# Altium schematic sheet 3_DAC.schdoc
size 431 x 309 mm; Symbol: Sheet-Symbol_A4; Device: Sheet-Symbol_A4; Company: EasyEDA.com; Drawed: EasyEDA Pro; Reviewed: EasyEDA Pro; Version: V0.1; Page Size: A4; @Project Name: Scanning Tunneling Microscope; @Page Count: 3; @Update Date: 2023-05-18; @Create Date: 2023-04-30; @Schematic Name: Controller; Part Number: JLCPCB-002; @Page No: 1; @Page Name: DAC
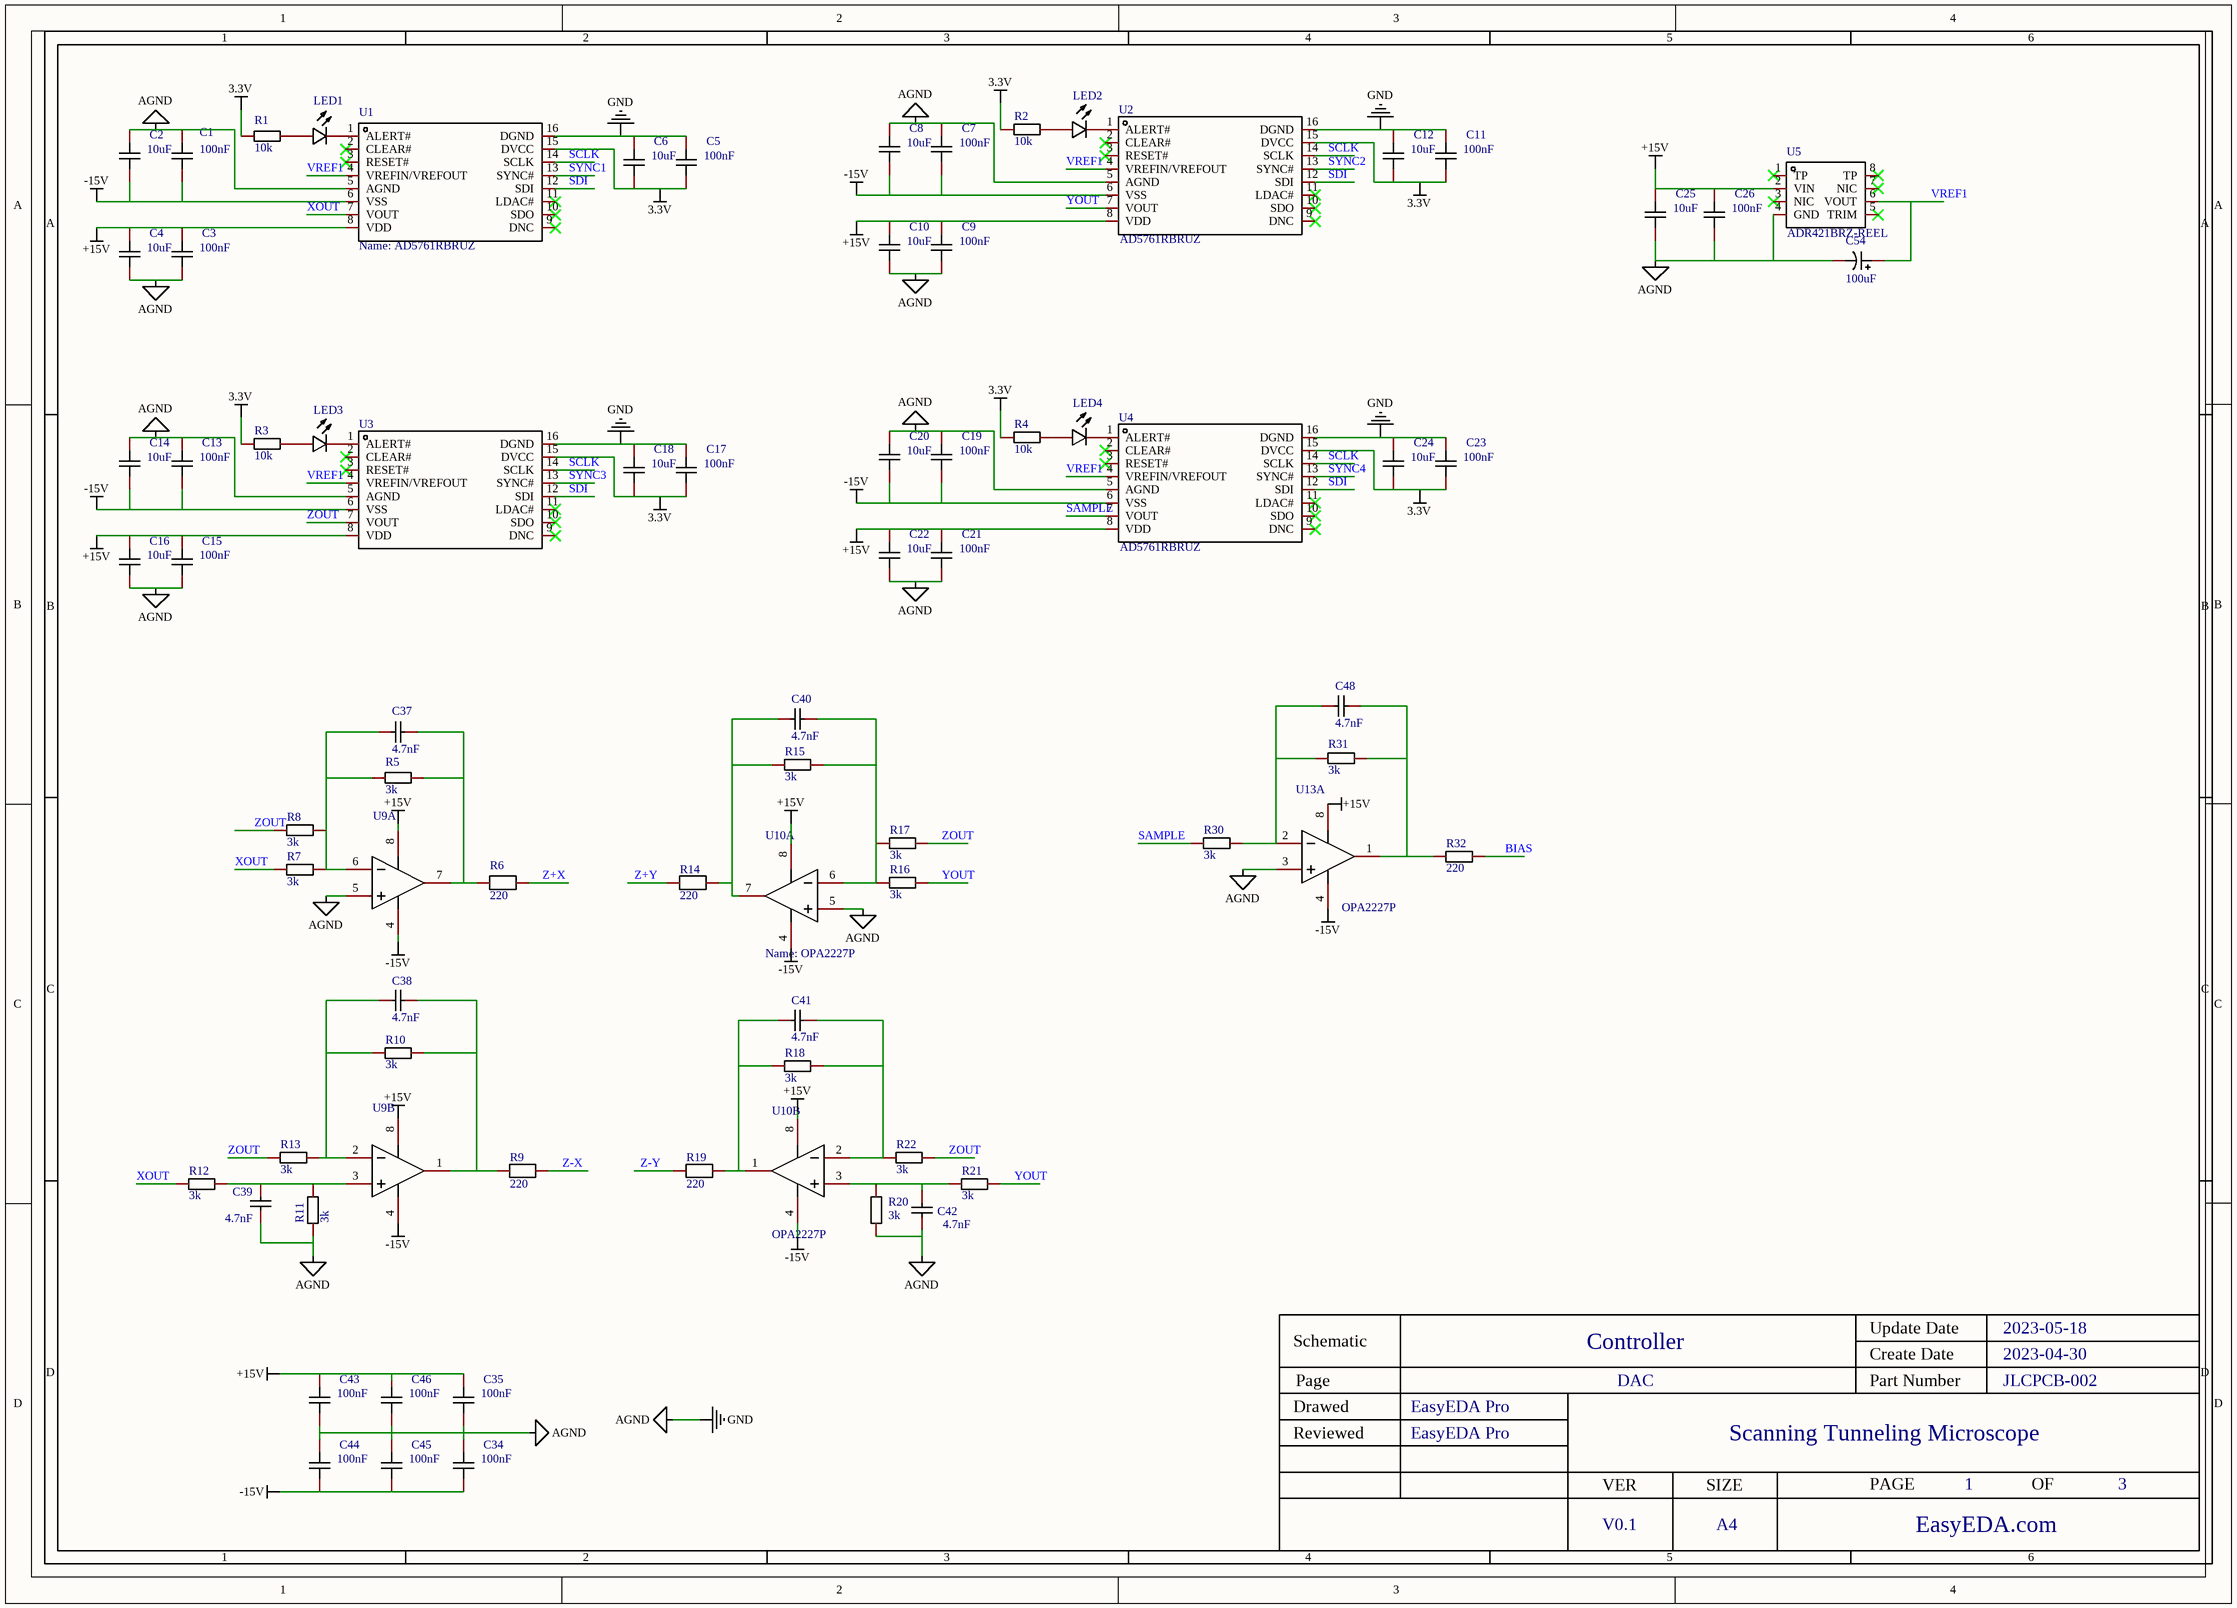
[diagram p0: 3_DAC.schdoc]

## Parts
C1  value 100nF  [C0603]  (hidden comment: CL10B104KA8NNNC)
C2  value 10uF  [C0603]  (hidden comment: GRM188R61E106MA73D)
C3  value 100nF  [C0603]  (hidden comment: CL10B104KA8NNNC)
C4  value 10uF  [C0603]  (hidden comment: GRM188R61E106MA73D)
C5  value 100nF  [C0603]  (hidden comment: CL10B104KA8NNNC)
C6  value 10uF  [C0603]  (hidden comment: GRM188R61E106MA73D)
C7  value 100nF  [C0603]  (hidden comment: CL10B104KA8NNNC)
C8  value 10uF  [C0603]  (hidden comment: GRM188R61E106MA73D)
C9  value 100nF  [C0603]  (hidden comment: CL10B104KA8NNNC)
C10  value 10uF  [C0603]  (hidden comment: GRM188R61E106MA73D)
C11  value 100nF  [C0603]  (hidden comment: CL10B104KA8NNNC)
C12  value 10uF  [C0603]  (hidden comment: GRM188R61E106MA73D)
C13  value 100nF  [C0603]  (hidden comment: CL10B104KA8NNNC)
C14  value 10uF  [C0603]  (hidden comment: GRM188R61E106MA73D)
C15  value 100nF  [C0603]  (hidden comment: CL10B104KA8NNNC)
C16  value 10uF  [C0603]  (hidden comment: GRM188R61E106MA73D)
C17  value 100nF  [C0603]  (hidden comment: CL10B104KA8NNNC)
C18  value 10uF  [C0603]  (hidden comment: GRM188R61E106MA73D)
C19  value 100nF  [C0603]  (hidden comment: CL10B104KA8NNNC)
C20  value 10uF  [C0603]  (hidden comment: GRM188R61E106MA73D)
C21  value 100nF  [C0603]  (hidden comment: CL10B104KA8NNNC)
C22  value 10uF  [C0603]  (hidden comment: GRM188R61E106MA73D)
C23  value 100nF  [C0603]  (hidden comment: CL10B104KA8NNNC)
C24  value 10uF  [C0603]  (hidden comment: GRM188R61E106MA73D)
C25  value 10uF  [C0603]  (hidden comment: GRM188R61E106MA73D)
C26  value 100nF  [C0603]  (hidden comment: CL10B104KA8NNNC)
C34  value 100nF  [C0603]  (hidden comment: CL10B104KA8NNNC)
C35  value 100nF  [C0603]  (hidden comment: CL10B104KA8NNNC)
C37  value 4.7nF  [C0603]  (hidden comment: 0603B472K500NT)
C38  value 4.7nF  [C0603]  (hidden comment: 0603B472K500NT)
C39  value 4.7nF  [C0603]  (hidden comment: 0603B472K500NT)
C40  value 4.7nF  [C0603]  (hidden comment: 0603B472K500NT)
C41  value 4.7nF  [C0603]  (hidden comment: 0603B472K500NT)
C42  value 4.7nF  [C0603]  (hidden comment: 0603B472K500NT)
C43  value 100nF  [C0603]  (hidden comment: CL10B104KA8NNNC)
C44  value 100nF  [C0603]  (hidden comment: CL10B104KA8NNNC)
C45  value 100nF  [C0603]  (hidden comment: CL10B104KA8NNNC)
C46  value 100nF  [C0603]  (hidden comment: CL10B104KA8NNNC)
C48  value 4.7nF  [C0603]  (hidden comment: 0603B472K500NT)
C54  100uF  [CAP-SMD_L7.3-W4.3-FD]
LED1  19-217/R6C-AL1M2VY/3T  [LED0603-R-RD]  (value not drawn)
LED2  19-217/R6C-AL1M2VY/3T  [LED0603-R-RD]  (value not drawn)
LED3  19-217/R6C-AL1M2VY/3T  [LED0603-R-RD]  (value not drawn)
LED4  19-217/R6C-AL1M2VY/3T  [LED0603-R-RD]  (value not drawn)
R1  value 10k  [R0603]  (hidden comment: 0603WAF1002T5E)
R2  value 10k  [R0603]  (hidden comment: 0603WAF1002T5E)
R3  value 10k  [R0603]  (hidden comment: 0603WAF1002T5E)
R4  value 10k  [R0603]  (hidden comment: 0603WAF1002T5E)
R5  value 3k  [R0603]  (hidden comment: ARG03DTC3001)
R6  value 220  [R0603]  (hidden comment: ERJU3RD2200V)
R7  value 3k  [R0603]  (hidden comment: ARG03DTC3001)
R8  value 3k  [R0603]  (hidden comment: ARG03DTC3001)
R9  value 220  [R0603]  (hidden comment: ERJU3RD2200V)
R10  value 3k  [R0603]  (hidden comment: ARG03DTC3001)
R11  value 3k  [R0603]  (hidden comment: ARG03DTC3001)
R12  value 3k  [R0603]  (hidden comment: ARG03DTC3001)
R13  value 3k  [R0603]  (hidden comment: ARG03DTC3001)
R14  value 220  [R0603]  (hidden comment: ERJU3RD2200V)
R15  value 3k  [R0603]  (hidden comment: ARG03DTC3001)
R16  value 3k  [R0603]  (hidden comment: ARG03DTC3001)
R17  value 3k  [R0603]  (hidden comment: ARG03DTC3001)
R18  value 3k  [R0603]  (hidden comment: ARG03DTC3001)
R19  value 220  [R0603]  (hidden comment: ERJU3RD2200V)
R20  value 3k  [R0603]  (hidden comment: ARG03DTC3001)
R21  value 3k  [R0603]  (hidden comment: ARG03DTC3001)
R22  value 3k  [R0603]  (hidden comment: ARG03DTC3001)
R30  value 3k  [R0603]  (hidden comment: ARG03DTC3001)
R31  value 3k  [R0603]  (hidden comment: ARG03DTC3001)
R32  value 220  [R0603]  (hidden comment: ARG03DTC3001)
U1  AD5761RBRUZ  [TSSOP-16_L5.0-W4.4-P0.65-LS6.4-TL]
U2  AD5761RBRUZ  [TSSOP-16_L5.0-W4.4-P0.65-LS6.4-TL]
U3  AD5761RBRUZ  [TSSOP-16_L5.0-W4.4-P0.65-LS6.4-TL]  (value not drawn)
U4  AD5761RBRUZ  [TSSOP-16_L5.0-W4.4-P0.65-LS6.4-TL]
U5  ADR421BRZ-REEL  [SOIC-8_L4.9-W3.9-P1.27-LS6.0-BL]
U9  OPA2227P  [PDIP-8_L9.6-W6.4-P2.54-LS7.6-BL]  (value not drawn)  (parts A,B of 2)
U10  OPA2227P  [PDIP-8_L9.6-W6.4-P2.54-LS7.6-BL]  (parts A,B of 2)
U13  OPA2227P  [PDIP-8_L9.6-W6.4-P2.54-LS7.6-BL]  (part A of 2)

## Nets
3.3V: C5.1 C6.1 C11.1 C12.1 C17.1 C18.1 C23.1 C24.1 R1.1 R2.1 R3.1 R4.1 U1.15(DVCC) U2.15(DVCC) U3.15(DVCC) U4.15(DVCC)
+15V: C3.2 C4.2 C9.2 C10.2 C15.2 C16.2 C21.2 C22.2 C25.2 C26.2 C35.2 C43.2 C46.2 U1.8(VDD) U2.8(VDD) U3.8(VDD) U4.8(VDD) U5.2(VIN) U9.8(V+) U10.8(V+) U13.8(V+)
-15V: C1.1 C2.1 C7.1 C8.1 C13.1 C14.1 C19.1 C20.1 C34.1 C44.1 C45.1 U1.6(VSS) U2.6(VSS) U3.6(VSS) U4.6(VSS) U9.4(V-) U10.4(V-) U13.4(V-)
AGND: C1.2 C2.2 C3.1 C4.1 C5.2 C6.2 C7.2 C8.2 C9.1 C10.1 C11.2 C12.2 C13.2 C14.2 C15.1 C16.1 C17.2 C18.2 C19.2 C20.2 C21.1 C22.1 C23.2 C24.2 C25.1 C26.1 C34.2 C35.1 C39.1 C42.2 C43.1 C44.2 C45.2 C46.1 C54.2 R11.1 R20.2 U1.5(AGND) U1.16(DGND) U2.5(AGND) U2.16(DGND) U3.5(AGND) U3.16(DGND) U4.5(AGND) U4.16(DGND) U5.4(GND) U9.5(IN_B+) U10.5(IN_B+) U13.3(INA+)  [also labelled GND]
BIAS: R32.2
SAMPLE: R30.1 U4.7(VOUT)
SCLK: U1.14(SCLK) U2.14(SCLK) U3.14(SCLK) U4.14(SCLK)
SDI: U1.12(SDI) U2.12(SDI) U3.12(SDI) U4.12(SDI)
SYNC1: U1.13(SYNC#)
SYNC2: U2.13(SYNC#)
SYNC3: U3.13(SYNC#)
SYNC4: U4.13(SYNC#)
VREF1: C54.1 U1.4(VREFIN/VREFOUT) U2.4(VREFIN/VREFOUT) U3.4(VREFIN/VREFOUT) U4.4(VREFIN/VREFOUT) U5.6(VOUT)
XOUT: R7.1 R12.1 U1.7(VOUT)
YOUT: R16.2 R21.2 U2.7(VOUT)
Z+X: R6.2
Z+Y: R14.1
Z-X: R9.2
Z-Y: R19.1
ZOUT: R8.1 R13.1 R17.2 R22.2 U3.7(VOUT)
NetC37_1: C37.1 R5.1 R7.2 R8.2 U9.6(IN_B-)
NetC37_2: C37.2 R5.2 R6.1 U9.7(OUT_B)
NetC38_1: C38.1 R10.1 R13.2 U9.2(IN_A-)
NetC38_2: C38.2 R9.1 R10.2 U9.1(OUT_A)
NetC39_2: C39.2 R11.2 R12.2 U9.3(IN_A+)
NetC40_1: C40.1 R14.2 R15.1 U10.7(OUT_B)
NetC40_2: C40.2 R15.2 R16.1 R17.1 U10.6(IN_B-)
NetC41_1: C41.1 R18.1 R19.2 U10.1(OUT_A)
NetC41_2: C41.2 R18.2 R22.1 U10.2(IN_A-)
NetC42_1: C42.1 R20.1 R21.1 U10.3(IN_A+)
NetC48_1: C48.1 R30.2 R31.1 U13.2(INA-)
NetC48_2: C48.2 R31.2 R32.1 U13.1(OUTA)
NetLED1_1: LED1.1(A) R1.2
NetLED1_2: LED1.2(C) U1.1(ALERT#)
NetLED2_1: LED2.1(A) R2.2
NetLED2_2: LED2.2(C) U2.1(ALERT#)
NetLED3_1: LED3.1(A) R3.2
NetLED3_2: LED3.2(C) U3.1(ALERT#)
NetLED4_1: LED4.1(A) R4.2
NetLED4_2: LED4.2(C) U4.1(ALERT#)

Not connected (* = marked no-connect by the designer): U1 2(CLEAR#)* 3(RESET#)* 9(DNC)* 10(SDO)* 11(LDAC#)*; U2 2(CLEAR#)* 3(RESET#)* 9(DNC)* 10(SDO)* 11(LDAC#)*; U3 2(CLEAR#)* 3(RESET#)* 9(DNC)* 10(SDO)* 11(LDAC#)*; U4 2(CLEAR#)* 3(RESET#)* 9(DNC)* 10(SDO)* 11(LDAC#)*; U5 1(TP)* 3(NIC)* 5(TRIM)* 7(NIC)* 8(TP)*

## Notes on the sheet
- 1
- 2
- 3
- 4
- 5
- 6
- A
- B
- C
- D
- Schematic
- Controller
- Create Date
- Update Date
- 2023-05-18
- 2023-04-30
- Reviewed
- Drawed
- Page
- EasyEDA Pro
- DAC
- Part Number
- Scanning Tunneling Microscope
- JLCPCB-002
- VER
- SIZE
- PAGE
- OF
- V0.1
- A4
- EasyEDA.com

## Library data of the parts
C1 C3 C5 C7 C9 C11 C13 C15 C17 C19 C21 C23 C26 C34 C35 C43-C46 = CL10B104KA8NNNC: 容值:100nF;精度:±10%;额定电压:25V;温度系数:X7R;; Manufacturer: SAMSUNG(三星); Add into BOM: yes; Tolerance: ±10%; Voltage Rated: 25V; Temperature Coefficient: X7R; Symbol: CL10B104KA8NNNC; Device: CL10B104KA8NNNC; LCSC Part Name: 100nF ±10% 25V; Supplier Part: C1590; Manufacturer Part: CL10B104KA8NNNC; Supplier Footprint: 0603; JLCPCB Part Class: Extended Part; Datasheet: https://atta.szlcsc.com/upload/public/pdf/source/20160103/1457707680294.pdf; Supplier: LCSC; Convert to PCB: yes
C2 C4 C6 C8 C10 C12 C14 C16 C18 C20 C22 C24 C25 = GRM188R61E106MA73D: 容值:10uF;精度:±20%;额定电压:25V;温度系数:X5R;; Manufacturer: muRata(村田); Add into BOM: yes; Tolerance: ±20%; Voltage Rated: 25V; Temperature Coefficient: X5R; Symbol: GRM188R61E106MA73D; Device: GRM188R61E106MA73D; LCSC Part Name: 10uF ±20% 25V; Supplier Part: C91606; Manufacturer Part: GRM188R61E106MA73D; Supplier Footprint: 0603; JLCPCB Part Class: Extended Part; Datasheet: https://atta.szlcsc.com/upload/public/pdf/source/20161226/1482720176185.pdf; Supplier: LCSC; Convert to PCB: yes
C37-C42 C48 = 0603B472K500NT: 容值:4.7nF;精度:±10%;额定电压:50V;温度系数:X7R;; Manufacturer: FH(风华); Add into BOM: yes; Tolerance: ±10%; Voltage Rated: 50V; Temperature Coefficient: X7R; Symbol: 0603B472K500NT; Device: 0603B472K500NT; LCSC Part Name: 4.7nF ±10% 50V; Supplier Part: C53987; Manufacturer Part: 0603B472K500NT; Supplier Footprint: 0603; JLCPCB Part Class: Basic Part; Datasheet: https://atta.szlcsc.com/upload/public/pdf/source/20170923/C53987_1506149489951988835.pdf; Supplier: LCSC; Convert to PCB: yes
C54 = F931D107MNC: Capacitance: Tolerance:±20% Tolerance:±20% Rated Voltage: Leakage Current(DCL):- Ripple Current:- Equivalent Series Resistance(ESR):500mΩ@100kHz Operating Temperature:-55℃~+125℃ Operating Temperature:-55℃~+125℃; Manufacturer: Kyocera AVX; Add into BOM: yes; Tolerance: ±20%; Name: 100uF; Symbol: F931D107MNC; Device: F931D107MNC; LCSC Part Name: 100uF ±20% 20V; Supplier Part: C1870833; Manufacturer Part: F931D107MNC; Supplier Footprint: 2917; JLCPCB Part Class: Extended Part; Supplier: LCSC; Convert to PCB: yes; Value: 100uF; Leakage Current(DCL): -; Ripple Current: -; Equivalent Series Resistance(ESR): 500mΩ@100kHz; Operating Temperature: -55℃~+125℃
LED1-LED4 = 19-217/R6C-AL1M2VY/3T: 发光颜色:红灯;二极管配置:-;透镜颜色:无色透明;主波长:617.5nm;峰值波长:632nm;色温:-;光通量(25时):-;测试电流:5mA;正向电压(VF):2.2V;发光强度:28.5mcd;功率:60mW;发光角度:120°;安装方式:-;工作温度:-40~+85;; Manufacturer: EVERLIGHT(台湾亿光); Add into BOM: yes; Emitted Color: 红灯; Lens Color: 无色透明; Peak Wavelength: 632nm; Forward Current: 5mA; Forward Voltage (VF): 2.2V; Power Dissipation: 60mW; Viewing Angle: 120°; Symbol: 19-217/R6C-AL1M2VY/3T; Device: 19-217/R6C-AL1M2VY/3T; LCSC Part Name: 0603 红灯; Supplier Part: C72044; Manufacturer Part: 19-217/R6C-AL1M2VY/3T; Supplier Footprint: 0603; JLCPCB Part Class: Extended Part; Datasheet: https://atta.szlcsc.com/upload/public/pdf/source/20160507/1462613613821.pdf; Supplier: LCSC; Convert to PCB: yes; Diode Configuration: -; Dominant Wavelength: 617.5nm; Color Temperature: -; Luminous Flux (@25℃): -; Luminous Intensity: 28.5mcd; Mounting Sytle: -; Operating Temperature: -40~+85
R1-R4 = 0603WAF1002T5E: 电阻类型:厚膜电阻;阻值:10k;精度:±1%;功率:1/10W;温度系数:±100ppm/;最大工作电压:75V;工作温度范围:-55~+155;; Manufacturer: UNI-ROYAL(厚声); Add into BOM: yes; Tolerance: ±1%; Power(Watts): 1/10W; Overload Voltage (Max): 75V; Symbol: 0603WAF1002T5E; Device: 0603WAF1002T5E; LCSC Part Name: 10k ±1%; Supplier Part: C25804; Manufacturer Part: 0603WAF1002T5E; Supplier Footprint: 0603; JLCPCB Part Class: Basic Part; Datasheet: https://atta.szlcsc.com/upload/public/pdf/source/20200306/C422600_1E6D84923E4A46A82E41ADD87F860B5C.pdf; Supplier: LCSC; Convert to PCB: yes; Type: 厚膜电阻; Temperature Coefficient: ±100ppm/; Operating Temperature Range: -55~+155
R5 R7 R8 R10-R13 R15-R18 R20-R22 R30-R32 = ARG03DTC3001: 电阻类型:薄膜电阻;阻值:3k;精度:±0.5%;功率:100mW;温度系数:±25ppm/;最大工作电压:75V;工作温度范围:-55~+155;; Manufacturer: 光颉(Viking); Add into BOM: yes; Tolerance: ±0.5%; Power(Watts): 100mW; Temperature Coefficient: ±25ppm/; Overload Voltage (Max): 75V; Symbol: ARG03DTC3001; Device: ARG03DTC3001; LCSC Part Name: 3k ±0.5% 100mW; Supplier Part: C311916; Manufacturer Part: ARG03DTC3001; Supplier Footprint: 0603; JLCPCB Part Class: Extended Part; Datasheet: https://atta.szlcsc.com/upload/public/pdf/source/20181119/C311916_083AB72433BF5B624DBE6C035DD51480.pdf; Supplier: LCSC; Convert to PCB: yes; Type: 薄膜电阻; Operating Temperature Range: -55~+155
R6 R9 R14 R19 = ERJU3RD2200V: 阻值:220;精度:±0.5%;功率:100mW;温度系数:±50ppm/;最大工作电压:-;工作温度范围:-55~+155;; Manufacturer: PANASONIC(松下); Add into BOM: yes; Tolerance: ±0.5%; Power(Watts): 100mW; Temperature Coefficient: ±50ppm/; Symbol: ERJU3RD2200V; Device: ERJU3RD2200V; LCSC Part Name: 220 ±0.5% 100mW; Supplier Part: C491169; Manufacturer Part: ERJU3RD2200V; Supplier Footprint: 0603; JLCPCB Part Class: Extended Part; Datasheet: https://atta.szlcsc.com/upload/public/pdf/source/20200407/C491169_AC2E94AF70820CF85EC0143B46F9F0DA.pdf; Supplier: LCSC; Convert to PCB: yes; Overload Voltage (Max): -; Operating Temperature Range: -55~+155
U1-U4 = AD5761RBRUZ: D/A 位数:-;D/A通道数:-;输出类型:-;读写接口类型:-;; Manufacturer: ADI(亚德诺)/LINEAR; Add into BOM: yes; Symbol: AD5761RBRUZ; Device: AD5761RBRUZ; LCSC Part Name: AD5761RBRUZ; Supplier Part: C404015; Manufacturer Part: AD5761RBRUZ; Supplier Footprint: TSSOP-16; JLCPCB Part Class: Extended Part; Datasheet: https://atta.szlcsc.com/upload/public/pdf/source/20190722/C404015_21C88E48C88813C7B0010A18F7ED8816.pdf; Supplier: LCSC; Convert to PCB: yes; Number of Bits: -; Number of D/A Converters: -; Output Type: -; Data Interface: -; Reference Type: -; Voltage - Supply, Analog: -
  U1 U2 U4: Name: AD5761RBRUZ
U5 = ADR421BRZ-REEL: Manufacturer: ADI(亚德诺)/LINEAR; Add into BOM: yes; Name: ADR421BRZ-REEL; Symbol: ADR421BRZ-REEL; Device: ADR421BRZ-REEL; LCSC Part Name: ADR421BRZ-REEL; Supplier Part: C496503; Manufacturer Part: ADR421BRZ-REEL; Supplier Footprint: SOIC-8; JLCPCB Part Class: Extended Part; Datasheet: https://atta.szlcsc.com/upload/public/pdf/source/20200316/C496503_A1F080746FA87D9455D96FF2B5AA62EC.pdf; Supplier: LCSC; Convert to PCB: yes
U9 U10 = OPA2227P: 运放类型:General Purpose;放大器组数:2;增益带宽积（GBP）:8MHz;压摆率（SR）:2.3 V/us;电源电压:5V ~ 36V, ±2.5V ~ 18V;各通道供电电流:3.7mA;; Manufacturer: TI(德州仪器); Add into BOM: yes; Number of Circuits: 2; Gain Bandwidth Product（GBP）: 8MHz; Iq per channel (Typ): 3.7mA; Name: OPA2227P; Symbol: OPA2227P; Device: OPA2227P; LCSC Part Name: OPA2227P; Supplier Part: C1346534; Manufacturer Part: OPA2227P; Supplier Footprint: PDIP-8; JLCPCB Part Class: Extended Part; Datasheet: https://atta.szlcsc.com/upload/public/pdf/source/20210702/51099E56FC087785D4CD98B058FDBA2E.pdf; Supplier: LCSC; Convert to PCB: yes; Amplifier Type: General Purpose; Slew Rate（SR）: 2.3 V/us; Output Type: -; Supply Voltage（Single）: 5V ~ 36V, ±2.5V ~ 18V
U13 = OPA2227P: Manufacturer: TI(德州仪器); Add into BOM: yes; Name: OPA2227P; Symbol: OPA2227P; Device: OPA2227P; LCSC Part Name: OPA2227P; Supplier Part: C1346534; Manufacturer Part: OPA2227P; Supplier Footprint: PDIP-8; JLCPCB Part Class: Extended Part; Datasheet: https://atta.szlcsc.com/upload/public/pdf/source/20210702/51099E56FC087785D4CD98B058FDBA2E.pdf; Supplier: LCSC; Convert to PCB: yes